# Altium schematic sheet MotorCtrl.SchDoc
size A4; Revision: D.1(PCB.SCH)
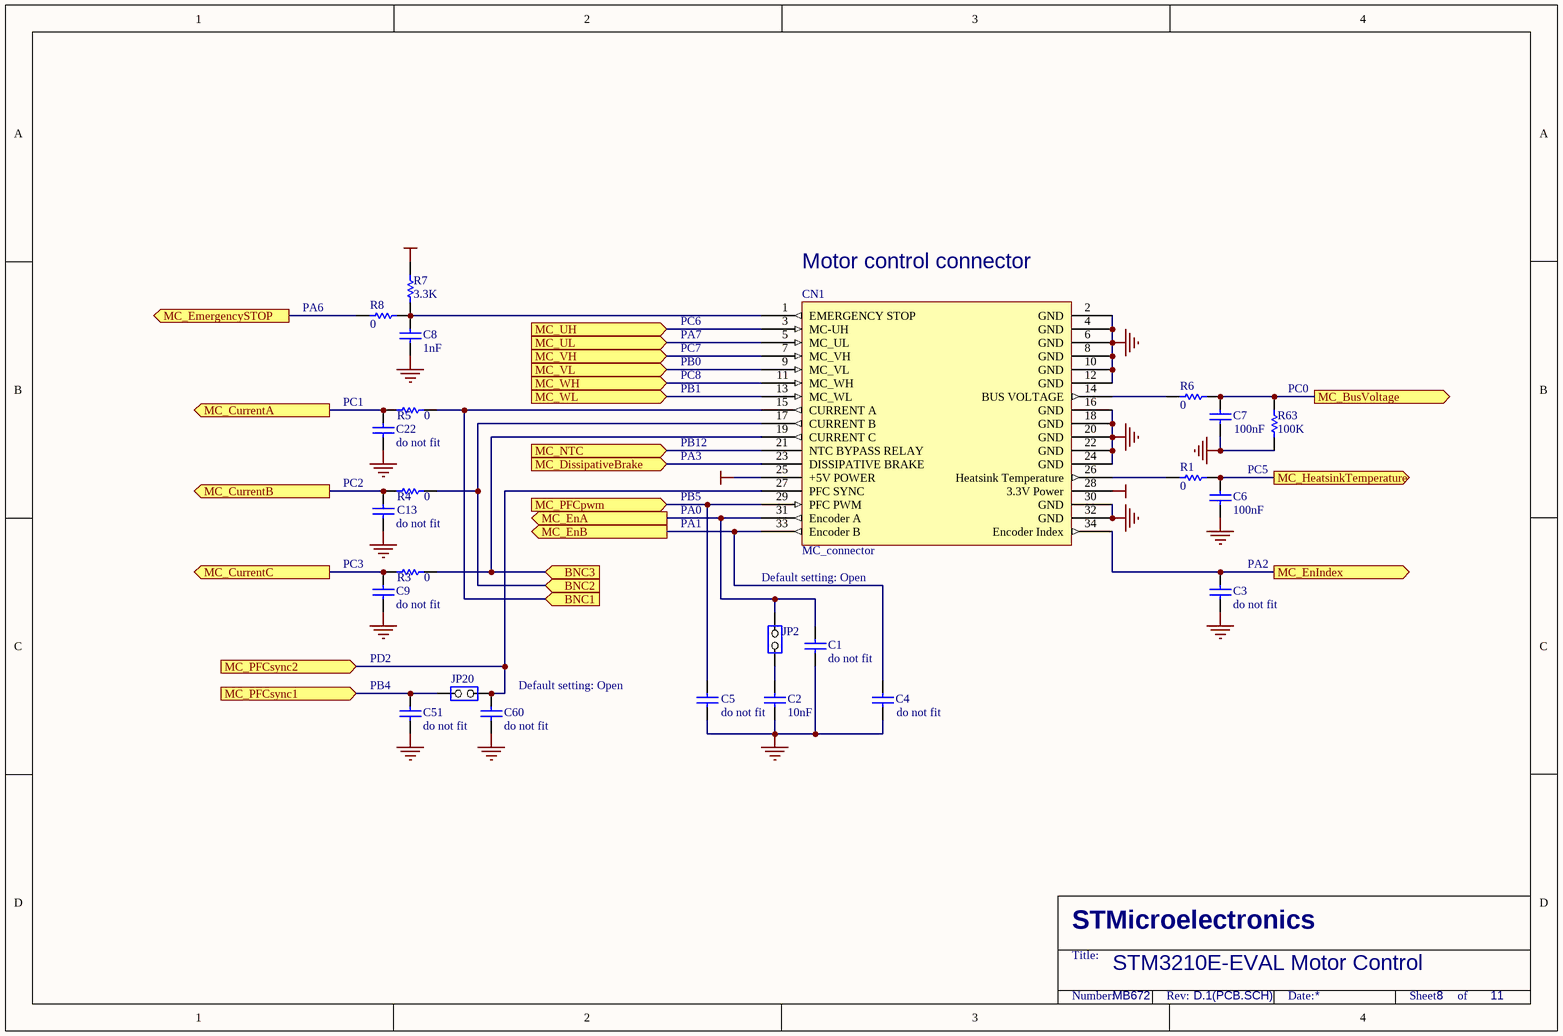
[diagram p0: MotorCtrl.SchDoc]

## Parts
C1  do not fit  [0603]
C2  10nF  [0603]
C3  do not fit  [0603]
C4  do not fit  [0603]
C5  do not fit  [0603]
C6  100nF  [0603]
C7  100nF  [0603]
C8  1nF  [0603]
C9  do not fit  [0603]
C13  do not fit  [0603]
C22  do not fit  [0603]
C51  do not fit  [0603]
C60  do not fit  [0603]
CN1  MC_connector  [IDC34S]
JP2  (no value)  [SIP2]
JP20  (no value)  [SIP2]
R1  0  [0603]
R3  0  [0603]
R4  0  [0603]
R5  0  [0603]
R6  0  [0603]
R7  3.3K  [0603]
R8  0  [0805]
R63  100K  [0603]

## Ports
BNC1 (in), BNC2 (in), BNC3 (in), MC_BusVoltage (out), MC_CurrentA (out), MC_CurrentB (out), MC_CurrentC (out), MC_DissipativeBrake (in), MC_EmergencySTOP (out), MC_EnA (out), MC_EnB (out), MC_EnIndex (out), MC_HeatsinkTemperature (out), MC_NTC (in), MC_PFCpwm (in), MC_PFCsync1 (in), MC_PFCsync2 (in), MC_UH (in), MC_UL (in), MC_VH (in), MC_VL (in), MC_WH (in), MC_WL (in)

## Nets
+3V3: CN1.28(3.3V_Power) R7.2
+5V: CN1.25(+5V_POWER)
GND: C1.1 C2.1 C3.1 C4.1 C5.1 C6.1 C7.1 C8.1 C9.1 C13.1 C22.1 C51.1 C60.1 CN1.2(GND) CN1.4(GND) CN1.6(GND) CN1.8(GND) CN1.10(GND) CN1.12(GND) CN1.16(GND) CN1.18(GND) CN1.20(GND) CN1.22(GND) CN1.24(GND) CN1.30(GND) CN1.32(GND) R63.1
BNC1: CN1.15(CURRENT_A) R5.2 ; port BNC1
BNC2: CN1.17(CURRENT_B) R4.2 ; port BNC2
BNC3: CN1.19(CURRENT_C) R3.2 ; port BNC3
MC_BusVoltage: C7.2 R6.2 R63.2 ; port MC_BusVoltage
MC_CurrentA: C22.2 R5.1 ; port MC_CurrentA
MC_CurrentB: C13.2 R4.1 ; port MC_CurrentB
MC_CurrentC: C9.2 R3.1 ; port MC_CurrentC
MC_DissipativeBrake: CN1.23(DISSIPATIVE_BRAKE) ; port MC_DissipativeBrake
MC_EmergencySTOP: R8.2 ; port MC_EmergencySTOP
MC_EnA: C1.2 CN1.31(Encoder_A) JP2.1(COMMON) ; port MC_EnA
MC_EnB: C4.2 CN1.33(Encoder_B) ; port MC_EnB
MC_EnIndex: C3.2 CN1.34(Encoder_Index) ; port MC_EnIndex
MC_HeatsinkTemperature: C6.2 R1.2 ; port MC_HeatsinkTemperature
MC_NTC: CN1.21(NTC_BYPASS_RELAY) ; port MC_NTC
MC_PFCpwm: C5.2 CN1.29(PFC_PWM) ; port MC_PFCpwm
MC_PFCsync1: C51.2 JP20.2(NO) ; port MC_PFCsync1
MC_PFCsync2: C60.2 CN1.27(PFC_SYNC) JP20.1(COMMON) ; port MC_PFCsync2
MC_UH: CN1.3(MC-UH) ; port MC_UH
MC_UL: CN1.5(MC_UL) ; port MC_UL
MC_VH: CN1.7(MC_VH) ; port MC_VH
MC_VL: CN1.9(MC_VL) ; port MC_VL
MC_WH: CN1.11(MC_WH) ; port MC_WH
MC_WL: CN1.13(MC_WL) ; port MC_WL
NetC2_2: C2.2 JP2.2(NO)
NetC8_2: C8.2 CN1.1(EMERGENCY_STOP) R7.1 R8.1
NetCN1_14: CN1.14(BUS_VOLTAGE) R6.1
NetCN1_26: CN1.26(Heatsink_Temperature) R1.1

## Notes on the sheet
- (near R8) PA6
- (near CN1) Motor control connector
- PC6
- PA7
- PC7
- PB0
- PC8
- PC1
- PB1
- PB12
- (near R63) PC0
- PC2
- PA3
- PA0
- PB5
- PC5
- PC3
- PA1
- Default setting: Open
- (near C3) PA2
- (near C51) PB4
- PD2
- (near C60) Default setting: Open
- STM3210E-EVAL Motor Control
- MB672
- 8
- 11
- STMicroelectronics
- Title:
- Number:
- Rev:
- Date:
- Sheet       of

## Library data of the parts
C1-C7 C9 C13 C22 C51 C60 = cap: Capacitor; Value: 100pF; Published: 8-Jun-2000; Revision: July-2002: Re-released for DXP Platform.; Publisher: Altium Limited
C8 = CAP: Capacitor; Value: 100pF; Published: 8-Jun-2000; Revision: July-2002: Re-released for DXP Platform.; Publisher: Altium Limited
JP2 JP20 = JP2
R1 R3-R8 R63 = Res1: Resistor; Value: 1K; Published: 8-Jun-2000; Revision: July-2002: Re-released for DXP Platform.; Publisher: Altium Limited